# EAGLE design uC_Sensor (EAGLE 8.6.0)
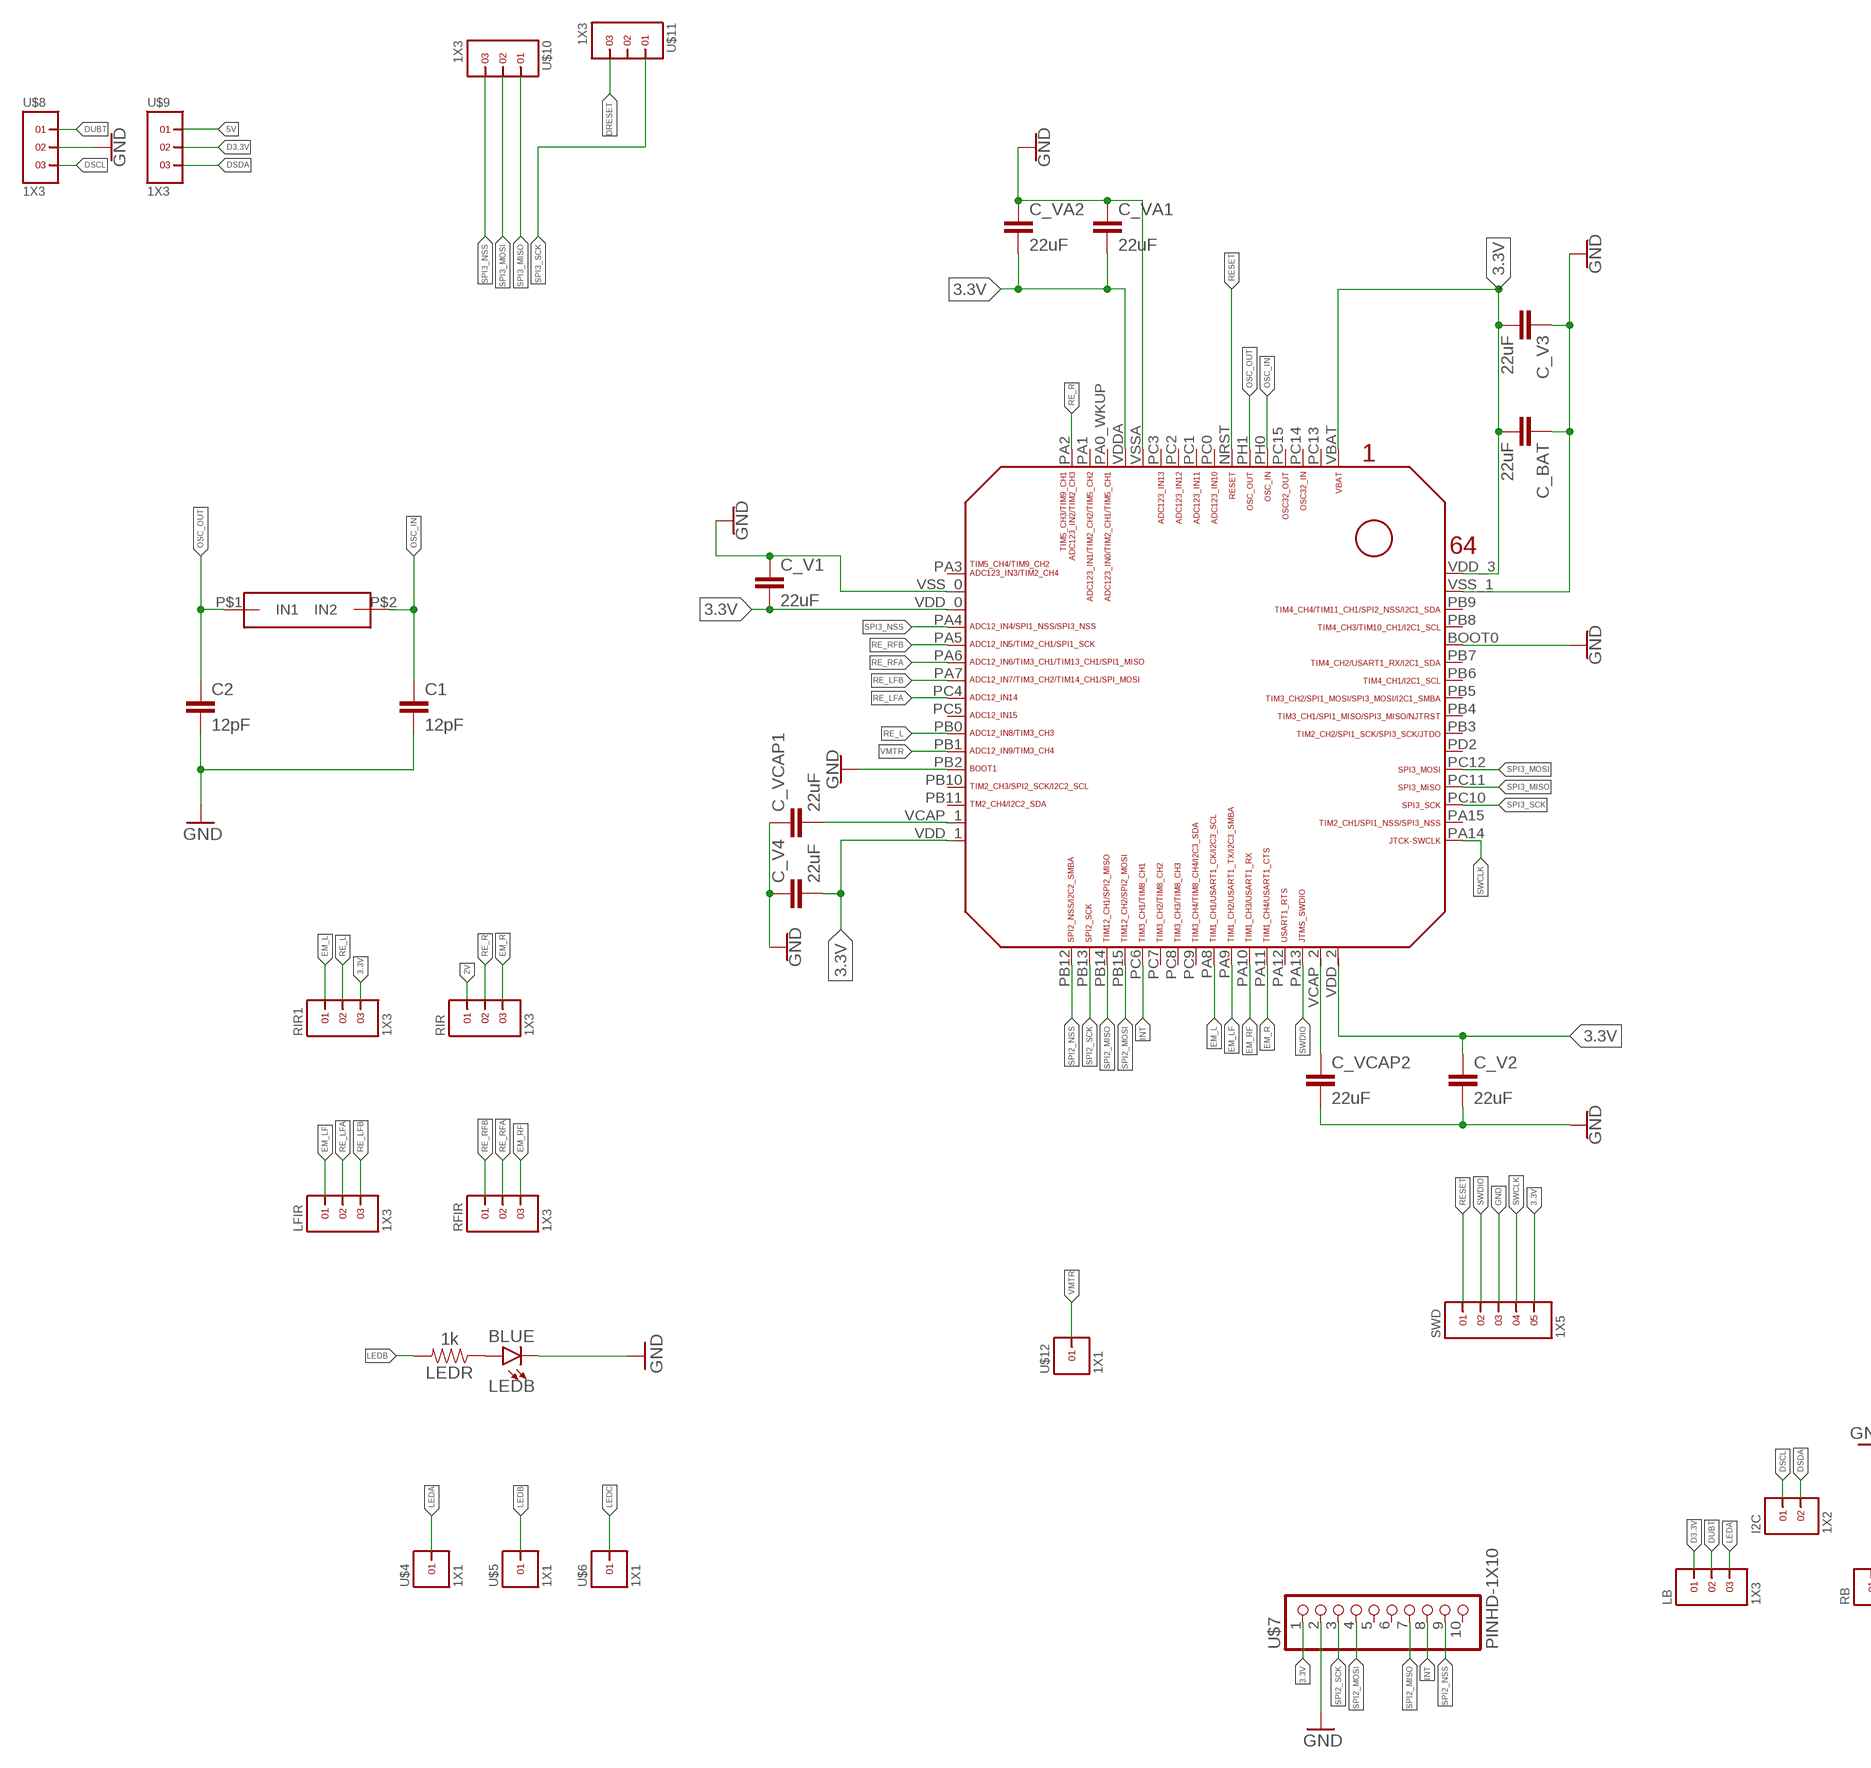
[diagram p0: schematic, sheet 1, part 1 of 2]
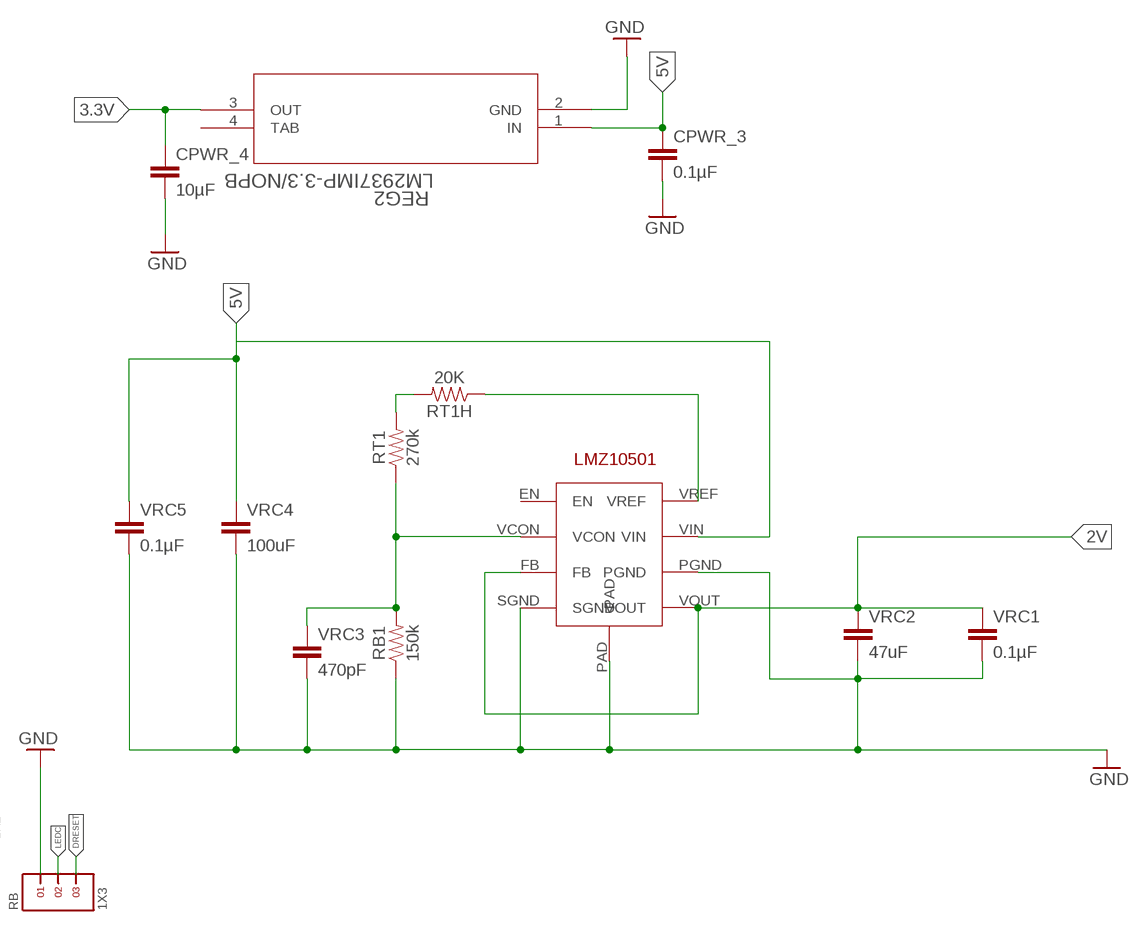
[diagram p1: schematic, sheet 1, part 2 of 2]

## Parts
C1  12pF  22PF-0603-50V-5%  [0603]
C2  12pF  22PF-0603-50V-5%  [0603]
C_BAT  22uF  22UF-0805-6.3V-20%  [0805]
C_V1  22uF  22UF-0805-6.3V-20%  [0805]
C_V2  22uF  22UF-0805-6.3V-20%  [0805]
C_V3  22uF  22UF-0805-6.3V-20%  [0805]
C_V4  22uF  22UF-0805-6.3V-20%  [0805]
C_VA1  22uF  22UF-0805-6.3V-20%  [0805]
C_VA2  22uF  22UF-0805-6.3V-20%  [0805]
C_VCAP1  22uF  22UF-0805-6.3V-20%  [0805]
C_VCAP2  22uF  22UF-0805-6.3V-20%  [0805]
CPWR_3  0.1µF  0.33UF/330NF-0805-50V-10%  [0805@2]
CPWR_4  10µF  0.33UF/330NF-0805-50V-10%  [0805@2]
I2C  1X2  [1X2]
LB  1X3  [1X3]
LEDB  BLUE  LED-BLUE1206  [LED-1206]
LEDR  1k  0.75OHM-0805-1/4W-1%  [0805]
LFIR  1X3  [1X3]
RB  1X3  [1X3]
RB1  150k  0.75OHM-0805-1/4W-1%  [0805]
REG2  LM2937IMP-3.3/NOPB  [MP04A]
RFIR  1X3  [1X3]
RIR  1X3  [1X3]
RIR1  1X3  [1X3]
RT1  270k  0.75OHM-0805-1/4W-1%  [0805]
RT1H  20K  0.75OHM-0805-1/4W-1%  [0805]
SWD  1X5  [1X5]
U$1  STM32F405/415_LQFP64  [STM32F405/415_LQFP64]
U$2  OSC  [OSC]
U$3  LMZ10501  [LMZ10501]
U$4  1X1  [1X1]
U$5  1X1  [1X1]
U$6  1X1  [1X1]
U$7  PINHD-1X10  [1X10-BIG]
U$8  1X3  [1X3]
U$9  1X3  [1X3]
U$10  1X3  [1X3]
U$11  1X3  [1X3]
U$12  1X1  [1X1]
VRC1  0.1µF  0.33UF/330NF-0805-50V-10%  [0805@2]
VRC2  47uF  0.33UF/330NF-0805-50V-10%  [0805@2]
VRC3  470pF  0.33UF/330NF-0805-50V-10%  [0805@2]
VRC4  100uF  0.33UF/330NF-0805-50V-10%  [0805@2]
VRC5  0.1µF  0.33UF/330NF-0805-50V-10%  [0805@2]

## Nets
2V: RIR.1 U$3.FB U$3.VOUT VRC1.1 VRC2.1
3.3V: C_BAT.2 C_V1.2 C_V2.1 C_V3.2 C_V4.2 C_VA1.2 C_VA2.2 CPWR_4.1 REG2.3(OUT) RIR1.3 SWD.5 U$1.VBAT U$1.VDD_0 U$1.VDD_1 U$1.VDD_2 U$1.VDD_3 U$1.VDDA U$7.1
5V: CPWR_3.1 REG2.1(IN) U$3.VIN U$9.1 VRC4.1 VRC5.1
D3.3V: LB.1 U$9.2
DRESET: RB.3 U$11.3
DSCL: I2C.1 U$8.3
DSDA: I2C.2 U$9.3
DUBT: LB.2 U$8.1
EM_L: RIR1.1 U$1.PA8
EM_LF: LFIR.1 U$1.PA9
EM_R: RIR.3 U$1.PA11
EM_RF: RFIR.3 U$1.PA10
GND: C1.2 C2.2 C_BAT.1 C_V1.1 C_V2.2 C_V3.1 C_V4.1 C_VA1.1 C_VA2.1 C_VCAP1.1 C_VCAP2.2 CPWR_3.2 CPWR_4.2 LEDB.C RB1.1 RB.1 REG2.2(GND) SWD.3 U$1.BOOT0 U$1.PB2 U$1.VSS_0 U$1.VSS_1 U$1.VSSA U$3.PAD U$3.PGND U$3.SGND U$7.2 U$8.2 VRC1.2 VRC2.2 VRC3.2 VRC4.2 VRC5.2
INT: U$1.PC6 U$7.8
LEDA: LB.3 U$4.1
LEDB: LEDR.2 U$5.1
LEDC: RB.2 U$6.1
N$1: RT1.2 RT1H.2
N$2: RB1.2 RT1.1 U$3.VCON VRC3.1
N$3: RT1H.1 U$3.VREF
N$4: LEDB.A LEDR.1
OSC_IN: C1.1 U$1.PH0 U$2.P$2(IN2)
OSC_OUT: C2.1 U$1.PH1 U$2.P$1(IN1)
RE_L: RIR1.2 U$1.PB0
RE_LFA: LFIR.2 U$1.PC4
RE_LFB: LFIR.3 U$1.PA7
RE_R: RIR.2 U$1.PA2
RE_RFA: RFIR.2 U$1.PA6
RE_RFB: RFIR.1 U$1.PA5
RESET: SWD.1 U$1.NRST
SPI2_MISO: U$1.PB14 U$7.7
SPI2_MOSI: U$1.PB15 U$7.4
SPI2_NSS: U$1.PB12 U$7.9
SPI2_SCK: U$1.PB13 U$7.3
SPI3_MISO: U$1.PC11 U$10.1
SPI3_MOSI: U$1.PC12 U$10.2
SPI3_NSS: U$1.PA4 U$10.3
SPI3_SCK: U$1.PC10 U$11.1
SWCLK: SWD.4 U$1.PA14
SWDIO: SWD.2 U$1.PA13
VCAP_1: C_VCAP1.2 U$1.VCAP_1
VCAP_2: C_VCAP2.1 U$1.VCAP_2
VMTR: U$1.PB1 U$12.1
Unconnected: U$1.PA0_WKUP(PA0_AKUP) U$1.PA1 U$1.PA3 U$1.PA12 U$1.PA15 U$1.PB3 U$1.PB4 U$1.PB5 U$1.PB6 U$1.PB7 U$1.PB8 U$1.PB9 U$1.PB10 U$1.PB11 U$1.PC0 U$1.PC1 U$1.PC2 U$1.PC3 U$1.PC5 U$1.PC7 U$1.PC8 U$1.PC9 U$1.PC13 U$1.PC14 U$1.PC15 U$1.PD2 U$3.EN U$7.5 U$7.6 U$7.10 U$11.2

## Power pins joined to a net without a drawn wire
TAB: REG2.4(TAB)

## Library data of the parts
C1 C2 = SparkFun-Capacitors:22PF: 22pF ceramic capacitors A capacitor is a passive two-terminal electrical component used to store electrical energy temporarily in an electric field.; PROD_ID: CAP-07876; VALUE: 22pF
C_BAT C_V1-C_V4 C_VA1 C_VA2 C_VCAP1 C_VCAP2 = SparkFun-Capacitors:22UF: 22µF ceramic capacitors A capacitor is a passive two-terminal electrical component used to store electrical energy temporarily in an electric field.; PROD_ID: CAP-08402
CPWR_3 CPWR_4 VRC1-VRC5 = SparkFun-Capacitors:0.33UF/330NF: 0.33¦ÌF/330nF ceramic capacitors A capacitor is a passive two-terminal electrical component used to store electrical energy temporarily in an electric field.; PROD_ID: CAP-08469; VALUE: 0.33¦ÌF
I2C = headers(2mm):1X2
LB LFIR RB RFIR RIR RIR1 U$8-U$11 = headers(2mm):1X3
LEDB = SparkFun-LED:LED-BLUE: Blue SMD LED Used in manufacturing of various products at SparkFun Packages: 0603 - SMD 0603 package [Product Link] <http://www.digikey.com/product-detail/en/SMLE12BC7TT86/511-1589-2-ND/1641808> 1206 - SMD1206 package [Product Link] <http://www.digikey.com/product-detail/en/lite-on-inc/LTST-C150TBKT/160-1643-1-ND/573584> SparkFun Products: ESP8266 Thing-Dev Board <https://www.sparkfun.com/products/13711> RedBoard <https://www.sparkfun.com/products/12757>; PROD_ID: DIO-09911
LEDR RB1 RT1 RT1H = SparkFun-Resistors:0.75OHM: 0.75Ω resistor A resistor is a passive two-terminal electrical component that implements electrical resistance as a circuit element. Resistors act to reduce current flow, and, at the same time, act to lower voltage levels within circuits. - Wikipedia; PROD_ID: RES-08474; VALUE: 0.75
REG2 = LM2937IMP-3.3:LM2937IMP-3.3/NOPB; COPYRIGHT: Copyright C 2015 Accelerated Designs. All rights reserved; MANUFACTURER_PART_NUMBER: lm2937imp3_3nopb; VENDOR: National Semiconductor
SWD = headers(2mm):1X5
U$1 = STM32F405RG:STM32F405/415_LQFP64
U$2 = Cristal Oscillator:OSC
U$3 = LMZ10501:LMZ10501
U$4-U$6 U$12 = headers(2mm):1X1
U$7 = adafruit:PINHD-1X10: Pin header 1x10 0.1" spacing With round pins

## Board
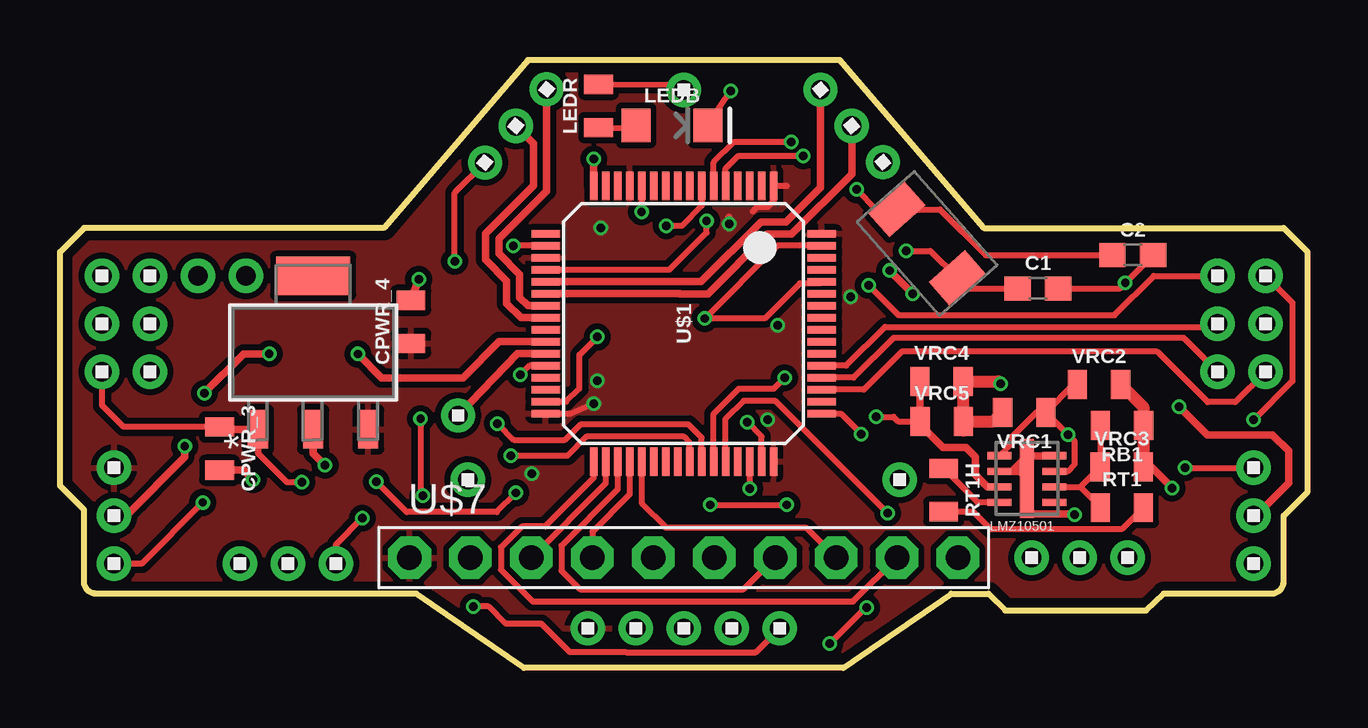
[diagram p2: board, top side]
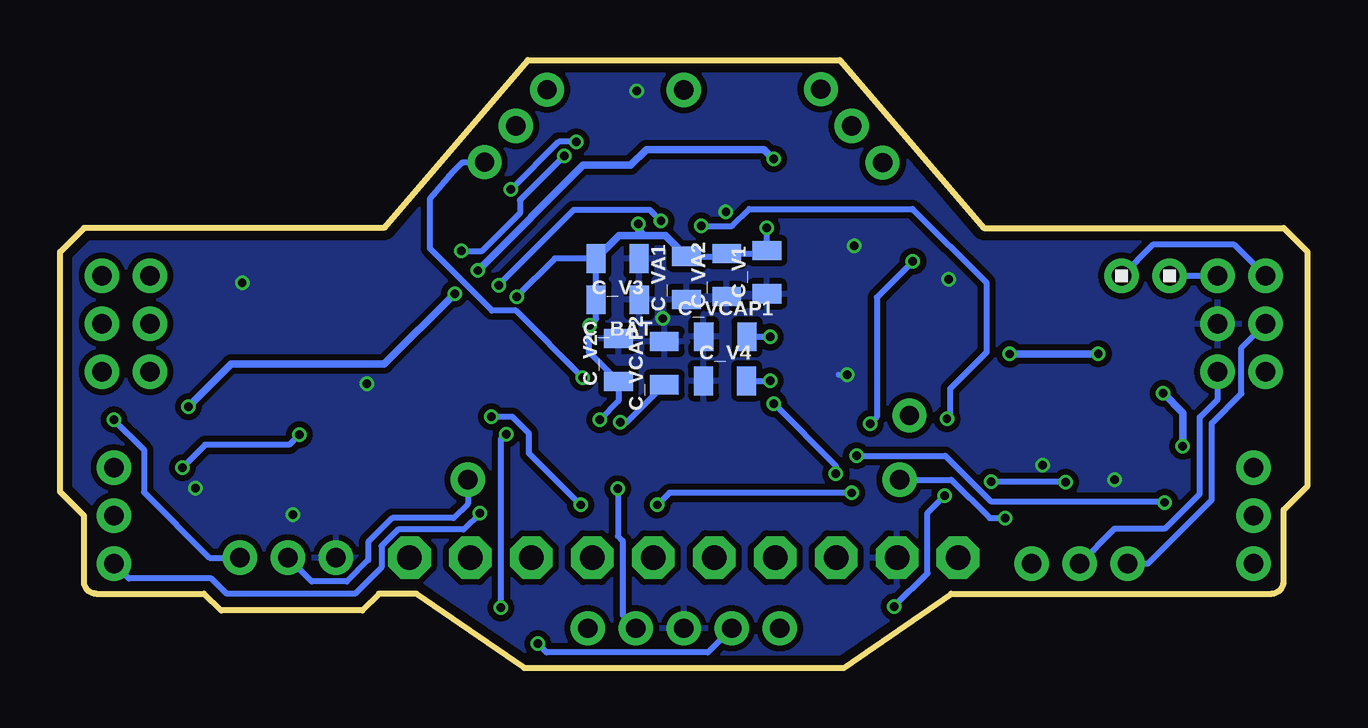
[diagram p3: board, bottom side, seen from below]

Size 52 x 25.35 mm. Coordinates in mm from the lower left corner, seen from the top.
Outline: 38.5,18.35 32.5,25.35 19.5,25.35 13.5,18.35 1,18.35 0,17.35 0,7.6 1,6.6 1,3.6 arc90 1.5,3.1 14.85,3.1 19.33,0 32.65,0 37.15,3.1 38.7,3.1 39.4,2.4 45.28,2.4 46,3.1 50.5,3.1 arc90 51,3.6 51,6.35 52,7.35 52,17.35 51,18.35 38.5,18.35
Copper layers (1*16): Top 0.035559375mm / dielectric 1.6mm / Bottom 0.035559375mm
Design rules "oshpark-2layer *": minimum track width 6mil, minimum drill 10mil, track to track 6mil, track to pad 6mil, pad to pad 6mil, via to via 6mil, smd to smd 6mil, copper to edge 15mil, drill to drill 6mil, minimum pad ring 5mil, minimum via ring 5mil, stop-mask expansion 0mil, vias tented up to drill 12mil, thermal gap 10mil

### Footprints (pad centres in the part's own frame; a part is rotated, then mirrored left to right if it is on the bottom)
0603 = smd 1.1 x 1: 1 -0.85,0; 2 0.85,0
0805 = smd 0.8 x 1.2: 1 -0.9,0; 2 0.9,0
0805@2 = smd 0.8 x 1.2: 1 -0.9,0; 2 0.9,0
1X2 = drill 0.8 pad 1.422: 1 -1,0; 2 1,0
1X3 = drill 0.8 pad 1.422: 1 -2,0; 2 0,0; 3 2,0
LED-1206 = smd 1.2 x 1.4: A -1.5,0; C 1.5,0
MP04A = smd 1.6 x 0.838: 1 -3.2,2.3; 2 -3.2,0; 3 -3.2,-2.3 | smd 1.6 x 3.099: 4 3.2,0
1X5 = drill 0.8 pad 1.422: 1 -4,0; 2 -2,0; 3 0,0; 4 2,0; 5 4,0
STM32F405/415_LQFP64 = smd 0.3 x 1.2: BOOT0 -1.75,5.75; PA3 -3.75,-5.75; PA4 -2.25,-5.75; PA5 -1.75,-5.75; PA6 -1.25,-5.75; PA7 -0.75,-5.75; PA14 3.75,5.75; PA15 3.25,5.75; PB0 0.75,-5.75; PB1 1.25,-5.75; PB2 1.75,-5.75; PB3 0.75,5.75; PB4 0.25,5.75; PB5 -0.25,5.75; PB6 -0.75,5.75; PB7 -1.25,5.75; PB8 -2.25,5.75; PB9 -2.75,5.75; PB10 2.25,-5.75; PB11 2.75,-5.75; PC4 -0.25,-5.75; PC5 0.25,-5.75; PC10 2.75,5.75; PC11 2.25,5.75; PC12 1.75,5.75; PD2 1.25,5.75; VCAP_1 3.25,-5.75; VDD_0 -2.75,-5.75; VDD_1 3.75,-5.75; VDD_3 -3.75,5.75; VSS_0 -3.25,-5.75; VSS_1 -3.25,5.75 | smd 1.2 x 0.3: NRST -5.75,0.75; PA0_WKUP -5.75,-2.75; PA1 -5.75,-3.25; PA2 -5.75,-3.75; PA8 5.75,0.25; PA9 5.75,0.75; PA10 5.75,1.25; PA11 5.75,1.75; PA12 5.75,2.25; PA13 5.75,2.75; PB12 5.75,-3.75; PB13 5.75,-3.25; PB14 5.75,-2.75; PB15 5.75,-2.25; PC0 -5.75,0.25; PC1 -5.75,-0.25; PC2 -5.75,-0.75; PC3 -5.75,-1.25; PC6 5.75,-1.75; PC7 5.75,-1.25; PC8 5.75,-0.75; PC9 5.75,-0.25; PC13 -5.75,3.25; PC14 -5.75,2.75; PC15 -5.75,2.25; PH0 -5.75,1.75; PH1 -5.75,1.25; VBAT -5.75,3.75; VCAP_2 5.75,3.25; VDD_2 5.75,3.75; VDDA -5.75,-2.25; VSSA -5.75,-1.75
OSC = smd 1.3 x 2: P$1 0,0.1; P$2 3.8,0.1
LMZ10501 = smd 1 x 0.3: EN -1.15,1; FB -1.15,-0.3; PGND 1.15,-0.3; SGND -1.15,-0.95; VCON -1.15,0.35; VIN 1.15,0.35; VOUT 1.15,-0.95; VREF 1.15,1 | smd 0.6 x 3.3: PAD 0,0
1X1 = drill 0.8 pad 1.422: 1 0,0
1X10-BIG = drill 1.016 pad 1.778 octagon: 1 -11.43,0; 2 -8.89,0; 3 -6.35,0; 4 -3.81,0; 5 -1.27,0; 6 1.27,0; 7 3.81,0; 8 6.35,0; 9 8.89,0; 10 11.43,0

### Placement (x,y rotation side)
C1  40.76,15.83 0 top
C2  44.72,17.21 0 top
C_BAT  28.75,15.35 180 bottom
C_V1  22.53,16.5 90 bottom
C_V2  28.72,12.84 90 bottom
C_V3  28.76,17.07 180 bottom
C_V4  24.28,11.97 0 bottom
C_VA1  25.88,16.26 90 bottom
C_VA2  24.21,16.38 90 bottom
C_VCAP1  24.27,13.81 359.9 bottom
C_VCAP2  26.81,12.71 90 bottom
CPWR_3  6.65,9.15 270 top
CPWR_4  14.63,14.43 90 top
I2C  6.75,16.35 180 bottom
LB  9.5,4.35 0 top
LEDB  25.51,22.62 0 top
LEDR  22.44,23.43 90 top
LFIR  19,22.6 49.9 top
RB  42.5,4.6 0 top
RB1  44.27,10.11 180 top
REG2  10.55,13.15 90 top
RFIR  33,22.6 310.7 top
RIR  49.75,6.35 270 top
RIR1  2.25,6.35 90 top
RT1  44.26,6.68 0 top
RT1H  36.84,7.42 270 top
SWD  26,1.65 180 top
U$1  26,14.35 270 top
U$2  34.81,19.05 311.4 top
U$3  40.3,7.9 180 top
U$4  17,7.85 0 top
U$5  26,24.1 0 top
U$6  35,7.85 0 top
U$7  26,4.6 0 top
U$8  3.75,14.35 90 top
U$9  1.75,14.35 90 top
U$10  48.25,14.35 90 top
U$11  50.25,14.35 90 top
U$12  16.59,10.53 0 top
VRC1  40.19,10.66 180 top
VRC2  43.31,11.81 0 top
VRC3  44.26,8.38 0 top
VRC4  36.74,11.95 0 top
VRC5  36.75,10.28 0 top

### Tracks (layer width: path | path; a pad name or v marks a point on that pad's centre or on a via)
2V  (via drill 0.35)
  Top 0.254: U$3.FB 42,8.2 42.3,8.5 42.3,9.45 v42.03,9.73 VRC1.1 | VRC1.1 40.71,10.66 39.7,9.65 39.7,9.4 U$3.VOUT | VRC1.1 42.25,11.81 VRC2.1 | v46.9,8.35 RIR.1
  Bottom 0.254: v42.03,9.73 42.45,9.3 45.95,9.3 v46.9,8.35
3.3V  (via drill 0.35)
  Top 0.254: U$1.VBAT 29.75,19.43 | U$1.VBAT 30.3,20.1 | 28.87,19.03 29.06,19.22 29.52,19.22 29.75,19.45 U$1.VBAT | v32.96,15.48 v32.95,15.47 32.95,15.3 | U$1.VDD_1 21.25,10.6 v22.25,11.02
  Top 0.305: 27.89,18.77 v27.89,18.52
  Bottom 0.254: v29.5,10.35 28.72,11.13 C_V2.1 29.95,13.17 29.95,14.25 v29.91,14.29 29.65,14.55 C_BAT.2 C_V3.2 31.37,17.07 v32.96,15.48 | C_V4.2 22.57,11.97 v22.39,11.97 | C_VA1.2 24.33,17.16 C_VA2.2 22.65,17.28 C_V1.2 22.53,18.33 v22.55,18.35 | v22.25,11.02 19.66,8.43 v19.66,8.1
  Bottom 0.305: C_V3.2 28.7,18.03 27.65,18.03 | C_VA1.2 26.75,18.03 27.65,18.03 | 27.65,18.03 27.89,18.27 v27.89,18.52
  pour Top (isolate 0.254): -14.7,31.35 -15.2,3.35 -12.7,-7.15 61.8,-7.15 67.8,13.85 60.8,28.35 56.8,33.85
5V  (via drill 0.35)
  Top 0.254: REG2.1 8.25,8.95 9.45,7.75 v10.08,7.75 | v19,7.3 18.2,6.5 14.45,6.5 v13.19,7.76 | v27.1,6.8 v30.3,6.8 | v34.02,10.47 34.74,10.47 34.93,10.28 35.84,10.28 VRC5.1 | CPWR_3.1 2.65,10.05 1.75,10.95 U$9.1
  Top 0.305: U$3.VIN 38.65,7.55 38.15,8.05 38.15,8.8 37.75,9.2 36.8,9.2 35.85,10.15 VRC5.1 VRC4.1 | REG2.1 6.75,9.95 CPWR_3.1
  Bottom 0.254: v19,7.3 26.6,7.3 v27.1,6.8 | v30.3,6.8 32.45,8.95 32.45,9.78 33.14,10.47 v34.02,10.47 | v10.08,7.75 13.18,7.75 v13.19,7.76
D3.3V
  Bottom 0.254: LB.1 6.65,4.35 4,7 4,10.2 2.76,11.44 2.76,13.34 U$9.2
DRESET  (via drill 0.35)
  Top 0.254: U$11.3 51.36,15.23 51.36,11.96 v49.75,10.35
  Bottom 0.254: RB.3 45.78,4.6 48.5,7.32 48.5,9.1 v49.75,10.35
DSCL
  Bottom 0.254: U$8.3 I2C.1
DSDA
  Bottom 0.254: U$9.3 3.05,17.65 6.45,17.65 I2C.2
DUBT
  Bottom 0.254: LB.2 8.05,5.8 5.95,5.8 4.5,7.25 4.5,10.45 3.75,11.2 U$8.1
EM_L  (via drill 0.35)
  Top 0.254: U$1.PA8 26.25,9.4 26,9.65 21.95,9.65 21.15,8.85 v18.8,8.85 | v5.95,6.9 3.4,4.35 RIR1.1
  Bottom 0.254: v18.8,8.85 15.1,8.85 13.2,6.95 6,6.95 v5.95,6.9
EM_LF  (via drill 0.35)
  Top 0.254: U$1.PA9 26.75,9.6 26.2,10.15 21.7,10.15 21.06,9.51 18.91,9.51 v18.23,10.19 | v16.45,16.95 16.45,19.81 LFIR.1
  Bottom 0.254: v16.45,16.95 17.95,15.45 17.95,10.47 v18.23,10.19
EM_R  (via drill 0.35)
  Top 0.254: U$1.PA11 27.75,10.4 28.5,11.15 29.8,11.15 v34.5,6.45
  Bottom 0.254: v34.5,6.45 35.18,5.77 37.91,5.77 38.6,5.08 38.6,4.19 39.7,3.09 45.05,3.09 45.69,3.74 49.14,3.74 RIR.3
EM_RF  (via drill 0.35)
  Top 0.254: U$1.PA10 27.25,10.6 28.3,11.65 29.75,11.65 v30.2,12.1
  Bottom 0.254: v30.2,12.1 33,14.9 33.99,14.9 36.58,17.49 36.58,19.57 35.61,20.7 35.23,21.08 RFIR.3
GND  (via drill 0.35)
  Top 0.254: C2.2 v44.4,16.05 44.18,15.83 C1.2 | LEDB.C 27.5,23.4 v27.95,24.05 | U$1.PB2 19.58,12.6 v19.2,12.22 | U$1.VSS_0 v18.9,17.6 | U$1.VSS_1 29.91,17.6 v26.88,14.57 29.38,14.57 30.84,16.03 31.68,16.03 U$1.BOOT0 | U$1.VSSA v24.25,19.03 v24.24,19.02 | 40.3,8.77 40.38,8.85
  Top 0.305: 40.38,8.85 U$3.SGND | REG2.2 10.55,8.95 v11.05,8.45 | CPWR_4.2 v14.95,16.2 | CPWR_3.2 7.65,8.25 v8.05,7.85 | 39.68,8.2 40,8.2 U$3.PAD 40.3,6.42 42.27,6.42 v42.3,6.39 | 39.68,8.2 U$3.PGND | 39.68,8.2 40.25,8.77 40.3,8.77 | VRC3.2 45.48,8.38 v46.36,7.5
  Top 0.508: 37.65,9.89 VRC5.2 | VRC3.2 RB1.1 45.17,10.86 VRC2.2 | VRC5.2 38.91,10.28 VRC1.2 | VRC5.2 37.65,11.94 VRC4.2 39.1,11.95 v39.2,11.85
  Bottom 0.254: v19.2,12.22 19.54,12.22
  Bottom 0.305: v42.3,6.39 42.3,6.28
  pour Bottom (isolate 0.254): -15.2,-2.15 13.3,-7.65 61.8,-6.65 66.8,16.85 65.8,31.35 52.3,36.35 8.3,36.85 -35.5,8.35
INT
  Top 0.254: U$1.PC6 24.25,6.87 25.26,5.86 31.09,5.86 U$7.8
LEDA  (via drill 0.35)
  Top 0.254: v12.6,6.25 11.5,5.15 LB.3
  Bottom 0.254: U$4.1 14.85,7.85 13.25,6.25 v12.6,6.25
LEDB
  Top 0.254: LEDR.2 25.79,24.31 U$5.1
LEDC
  Bottom 0.254: U$6.1 35,6.85 35.6,6.25 38.15,6.25 39.15,5.25 39.15,4.5 40.04,3.61 41.51,3.61 RB.2
N$1
  Top 0.254: RT1H.2 38.06,6.52 38.09,6.49 38.78,5.8 44.28,5.8 RT1.2
N$2
  Top 0.254: U$3.VCON 42.53,7.55 | 42.53,7.55 VRC3.1 43.36,10.1 RB1.2 | 42.53,7.55 43.36,6.72 RT1.1
N$3
  Top 0.254: U$3.VREF 38.25,6.9 RT1H.1
N$4
  Top 0.254: LEDR.1 24.41,22.51 LEDB.A
OSC_IN  (via drill 0.35)
  Top 0.254: v35.27,17.39 36.28,17.39 U$2.P$2 37.84,15.83 C1.1 | U$1.PH0 | U$1.PH0 27.75,20.82 28.28,21.35 v30.97,21.35
  Bottom 0.254: v35.27,17.39 34.4,17.39 32.83,18.96 32.83,19.5 v30.97,21.35
OSC_OUT  (via drill 0.35)
  Top 0.254: C2.1 38.59,17.21 36.68,19.12 U$2.P$1 34.04,19.12 v33.21,19.95 | U$1.PH1 27.25,21.08 28.1,21.94 v30.49,21.94
  Bottom 0.254: v30.49,21.94 31.22,21.94 v33.2,19.95 v33.21,19.95
RE_L  (via drill 0.35)
  Top 0.305: U$1.PB0 18.3,13.6 16.8,12.1 13.41,12.1 v12.42,13.09 | 2.8,6.35 2.75,6.35 | 2.75,6.35 RIR1.2 | v5.2,9.24 5.2,8.8 2.75,6.35 | v6.02,11.46 7.66,13.1 v8.72,13.1
  Bottom 0.305: v12.42,13.09 v8.73,13.09 v8.72,13.1 | v5.2,9.24 5.2,10.64 v6.02,11.46
RE_LFA
  Top 0.305: U$1.PC4 19.22,14.6 18.62,15.2 18.62,16.13 17.73,17.02 17.73,18.11 19.73,20.11 19.73,21.87 LFIR.2
RE_LFB
  Top 0.305: U$1.PA7 19.51,15.1 19.16,15.45 19.16,16.4 18.29,17.27 18.29,17.89 20.29,19.89 LFIR.3
RE_R  (via drill 0.35)
  Top 0.305: U$1.PA2 22.25,21.1 v22.25,21.22 | v34.58,16.57 v35.55,15.6 | v46.65,10.89 47.83,9.71 50.54,9.71 51.21,9.04 51.21,7.71 49.85,6.35 RIR.2
  Bottom 0.305: v46.65,10.89 44.87,12.67 38.48,12.67 v35.55,15.6 | v34.58,16.57 30.19,20.96 28.22,20.96 27.56,21.62 22.65,21.62 v22.25,21.22
RE_RFA
  Top 0.305: U$1.PA6 25.84,15.6 27.01,15.6 29.49,18.08 30.49,18.08 33,20.59 RFIR.2
RE_RFB
  Top 0.305: U$1.PA5 26.72,16.1 29.21,18.59 30.25,18.59 31.7,20.04 RFIR.1
RESET  (via drill 0.35)
  Top 0.254: U$1.NRST 26.75,19.26 25.92,18.43 v25.27,18.43 | v15.03,10.39 15.03,7.28 v15.13,7.18 | SWD.1 29.01,0.66 23.59,0.66 22.41,0.66 21.26,0.66 20.07,1.85 18.58,1.85 17.87,2.56 v17.23,2.56
  Bottom 0.254: v15.03,10.39 14.9,10.52 14.9,11.64 13.38,13.16 13.38,16.06 16.46,19.14 23.27,19.14 23.98,18.43 v25.27,18.43 | v15.13,7.18 15.84,6.47 15.84,3.95 v17.23,2.56
SPI2_MISO
  Top 0.254: U$1.PB14 23.25,7.45 20.9,5.1 20.9,4.05 21.67,3.28 28.49,3.28 U$7.7
SPI2_MOSI
  Top 0.254: U$1.PB15 23.75,7.24 22.19,5.68 U$7.4
SPI2_NSS
  Top 0.254: U$1.PB12 22.25,7.93 20.22,5.9 19.25,5.9 18.38,5.03 18.38,4.09 19.7,2.77 33.06,2.77 U$7.9
SPI2_SCK
  Top 0.254: U$1.PB13 22.75,7.7 U$7.3
SPI3_MISO
  Top 0.254: U$10.1 46.84,13.76 34.74,13.76 33.08,12.1 U$1.PC11
SPI3_MOSI
  Top 0.254: U$1.PC12 32.77,12.6 34.39,14.22 48.12,14.22 U$10.2
SPI3_NSS  (via drill 0.35)
  Top 0.254: U$1.PA4 25.4,16.6 26.95,18.15 v26.95,18.64 | U$10.3 45.59,16.35 43.95,14.71 34.95,14.71 v33.7,15.96
  Bottom 0.254: v26.95,18.64 27.41,19.1 30.59,19.1 33.7,15.99 v33.7,15.96
SPI3_SCK
  Top 0.254: U$11.1 48.98,11.08 47.84,11.08 45.73,13.19 35.09,13.19 33.5,11.6 U$1.PC10
SWCLK  (via drill 0.35)
  Top 0.254: U$1.PA14 32.55,10.6 v33.4,9.75 | v32.08,1.01 33.52,2.46 | 33.52,2.46 33.58,2.51 | v33.62,2.51 33.57,2.46 33.52,2.46
  Bottom 0.254: SWD.4 25,0.65 31.72,0.65 v32.08,1.01 | v33.4,9.75 33.62,9.53 v33.62,2.51
SWDIO  (via drill 0.35)
  Top 0.254: U$1.PA13 28.75,7.6 v28.75,7.47
  Bottom 0.254: v28.75,7.47 28.75,5.5 28.55,5.3 28.55,2.2 SWD.2
VCAP_1  (via drill 0.35)
  Top 0.254: U$1.VCAP_1 21.1,11.1 21.65,11.65 21.65,13.05 v22.4,13.8
  Bottom 0.254: v22.4,13.8 v22.41,13.81 C_VCAP1.2
VCAP_2  (via drill 0.35)
  Top 0.254: U$1.VCAP_2 29.25,9.65 v28.65,10.25
  Bottom 0.254: v28.65,10.25 28.37,10.25 C_VCAP2.1
VMTR
  Top 0.305: U$1.PB1 19.08,13.1 U$12.1